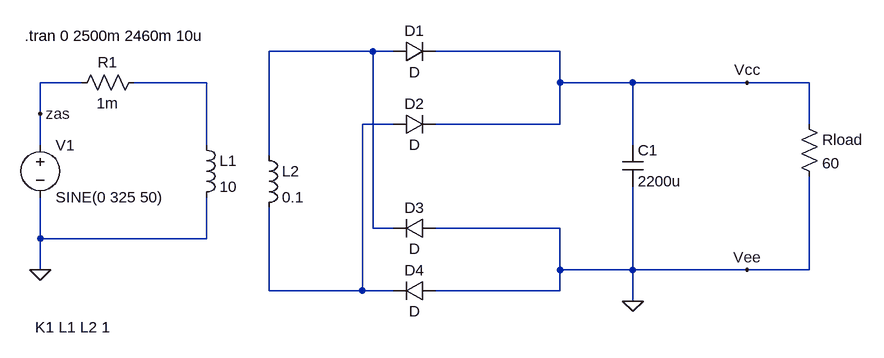
[diagram p0: schematic power_single.asc]
power_single.asc, the LTspice schematic file:
Version 4.1
SHEET 1 1648 1140
WIRE 576 64 416 64
WIRE 608 64 576 64
WIRE 864 64 672 64
WIRE 128 112 64 112
WIRE 320 112 208 112
WIRE 864 112 864 64
WIRE 976 112 864 112
WIRE 1152 112 976 112
WIRE 1248 112 1152 112
WIRE 64 160 64 112
WIRE 608 176 560 176
WIRE 864 176 864 112
WIRE 864 176 672 176
WIRE 1248 176 1248 112
WIRE 64 208 64 160
WIRE 320 208 320 112
WIRE 976 208 976 112
WIRE 416 224 416 64
WIRE 576 336 576 64
WIRE 608 336 576 336
WIRE 864 336 672 336
WIRE 64 352 64 288
WIRE 320 352 320 288
WIRE 320 352 64 352
WIRE 64 400 64 352
WIRE 864 400 864 336
WIRE 976 400 976 272
WIRE 976 400 864 400
WIRE 1152 400 976 400
WIRE 1248 400 1248 256
WIRE 1248 400 1152 400
WIRE 416 432 416 304
WIRE 560 432 560 176
WIRE 560 432 416 432
WIRE 608 432 560 432
WIRE 864 432 864 400
WIRE 864 432 672 432
WIRE 976 448 976 400
FLAG 64 400 0
FLAG 1152 112 Vcc
FLAG 64 160 zas
FLAG 976 448 0
FLAG 1152 400 Vee
SYMBOL voltage 64 192 R0
SYMATTR InstName V1
SYMATTR Value SINE(0 325 50)
SYMBOL res 224 96 R90
WINDOW 0 0 56 VBottom 2
WINDOW 3 32 56 VTop 2
SYMATTR InstName R1
SYMATTR Value 1m
SYMBOL ind 304 192 R0
SYMATTR InstName L1
SYMATTR Value 10
SYMATTR Type ind
SYMATTR SpiceLine Rser=1m
SYMBOL ind 400 208 R0
SYMATTR InstName L2
SYMATTR Value 0.1
SYMATTR Type ind
SYMATTR SpiceLine Rser=1m
SYMBOL diode 608 80 R270
WINDOW 0 32 32 VTop 2
WINDOW 3 0 32 VBottom 2
SYMATTR InstName D1
SYMBOL diode 608 192 R270
WINDOW 0 32 32 VTop 2
WINDOW 3 0 32 VBottom 2
SYMATTR InstName D2
SYMBOL diode 672 320 R90
WINDOW 0 0 32 VBottom 2
WINDOW 3 32 32 VTop 2
SYMATTR InstName D3
SYMBOL diode 672 416 R90
WINDOW 0 0 32 VBottom 2
WINDOW 3 32 32 VTop 2
SYMATTR InstName D4
SYMBOL cap 960 208 R0
SYMATTR InstName C1
SYMATTR Value 2200u
SYMBOL res 1232 160 R0
SYMATTR InstName Rload
SYMATTR Value 60
TEXT 56 488 Left 2 !K1 L1 L2 1
TEXT 40 40 Left 2 !.tran 0 2500m 2460m 10u

The netlist it stands for:
* power_single.asc
V1 zas 0 SINE(0 325 50)
R1 N002 zas 1m
L1 N002 0 10 Rser=1m
L2 N001 N003 0.1 Rser=1m
D1 N001 Vcc D
D2 N003 Vcc D
D3 0 N001 D
D4 0 N003 D
C1 Vcc 0 2200u
Rload Vcc 0 60
.model D D
.lib standard.dio
K1 L1 L2 1
.tran 0 2500m 2460m 10u
.backanno
.end